# EAGLE design Brava Monio (EAGLE 8.0.0)
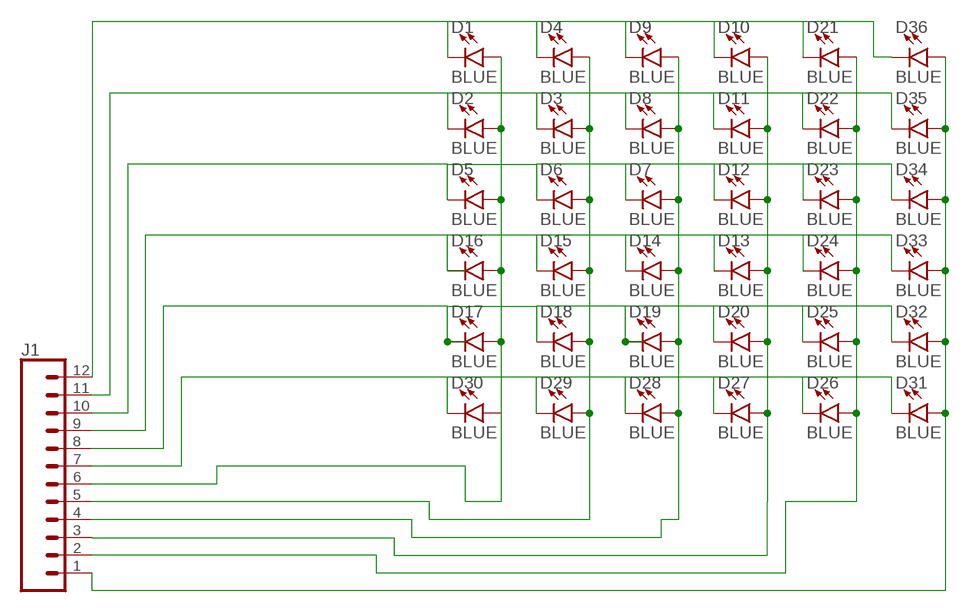
[diagram p0: schematic, sheet 1]

## Parts
D1  BLUE  LED-BLUE0603  [LED-0603]
D2  BLUE  LED-BLUE0603  [LED-0603]
D3  BLUE  LED-BLUE0603  [LED-0603]
D4  BLUE  LED-BLUE0603  [LED-0603]
D5  BLUE  LED-BLUE0603  [LED-0603]
D6  BLUE  LED-BLUE0603  [LED-0603]
D7  BLUE  LED-BLUE0603  [LED-0603]
D8  BLUE  LED-BLUE0603  [LED-0603]
D9  BLUE  LED-BLUE0603  [LED-0603]
D10  BLUE  LED-BLUE0603  [LED-0603]
D11  BLUE  LED-BLUE0603  [LED-0603]
D12  BLUE  LED-BLUE0603  [LED-0603]
D13  BLUE  LED-BLUE0603  [LED-0603]
D14  BLUE  LED-BLUE0603  [LED-0603]
D15  BLUE  LED-BLUE0603  [LED-0603]
D16  BLUE  LED-BLUE0603  [LED-0603]
D17  BLUE  LED-BLUE0603  [LED-0603]
D18  BLUE  LED-BLUE0603  [LED-0603]
D19  BLUE  LED-BLUE0603  [LED-0603]
D20  BLUE  LED-BLUE0603  [LED-0603]
D21  BLUE  LED-BLUE0603  [LED-0603]
D22  BLUE  LED-BLUE0603  [LED-0603]
D23  BLUE  LED-BLUE0603  [LED-0603]
D24  BLUE  LED-BLUE0603  [LED-0603]
D25  BLUE  LED-BLUE0603  [LED-0603]
D26  BLUE  LED-BLUE0603  [LED-0603]
D27  BLUE  LED-BLUE0603  [LED-0603]
D28  BLUE  LED-BLUE0603  [LED-0603]
D29  BLUE  LED-BLUE0603  [LED-0603]
D30  BLUE  LED-BLUE0603  [LED-0603]
D31  BLUE  LED-BLUE0603  [LED-0603]
D32  BLUE  LED-BLUE0603  [LED-0603]
D33  BLUE  LED-BLUE0603  [LED-0603]
D34  BLUE  LED-BLUE0603  [LED-0603]
D35  BLUE  LED-BLUE0603  [LED-0603]
D36  BLUE  LED-BLUE0603  [LED-0603]
J1  CONN_12LONGPADS  [1X12_LONGPADS]

## Nets
N$1: D1.A D2.A D5.A D16.A D17.A D30.A J1.6
N$2: D3.A D4.A D6.A D15.A D18.A D29.A J1.5
N$3: D7.A D8.A D9.A D14.A D19.A D28.A J1.4
N$4: D10.A D11.A D12.A D13.A D20.A D27.A J1.3
N$5: D21.A D22.A D23.A D24.A D25.A D26.A J1.2
N$6: D31.A D32.A D33.A D34.A D35.A D36.A J1.1
N$7: D1.C D4.C D9.C D10.C D21.C D36.C J1.12
N$8: D2.C D3.C D8.C D11.C D22.C D35.C J1.11
N$9: D5.C D6.C D7.C D12.C D23.C D34.C J1.10
N$10: D13.C D14.C D15.C D16.C D24.C D33.C J1.9
N$12: D17.C D18.C D19.C D20.C D25.C D32.C J1.8
N$13: D26.C D27.C D28.C D29.C D30.C D31.C J1.7

## Library data of the parts
D1-D36 = SparkFun-LED:LED-BLUE: Blue SMD LED Used in manufacturing of various products at SparkFun Packages: 0603 - SMD 0603 package [Product Link] <http://www.digikey.com/product-detail/en/SMLE12BC7TT86/511-1589-2-ND/1641808> 1206 - SMD1206 package [Product Link] <http://www.digikey.com/product-detail/en/lite-on-inc/LTST-C150TBKT/160-1643-1-ND/573584> SparkFun Products: ESP8266 Thing-Dev Board <https://www.sparkfun.com/products/13711> RedBoard <https://www.sparkfun.com/products/12757>; PROD_ID: DIO-08575
J1 = SparkFun-Connectors:CONN_12: Multi connection point. Often used as Generic Header-pin footprint for 0.1 inch spaced/style header connections On any of the 0.1 inch spaced packages, you can populate with these: Break Away Headers - Straight <https://www.sparkfun.com/products/116> (PRT-00116) Break Away Male Headers - Right Angle <https://www.sparkfun.com/products/553> (PRT-00553) Female Headers <https://www.sparkfun.com/products/115> (PRT-00115) Break Away Headers - Machine Pin <https://www.sparkfun.com/products/117> (PRT-00117) Break Away Female Headers - Swiss Machine Pin <https://www.sparkfun.com/products/743> (PRT-00743) For SCREWTERMINALS and SPRING TERMINALS visit here: Screw Terimnals on SparkFun.com <https://www.sparkfun.com/search/results?term=Screw+Terminals> (5mm/3.5mm/2.54mm spacing) This device is also useful as a general connection point to wire up your design to another part of your project. Our various solder wires solder well into these plated through hole pads. Hook-Up Wire - Assortment (Stranded, 22 AWG) <https://www.sparkfun.com/products/11375> (PRT-11375) Hook-Up Wire - Assortment (Solid Core, 22 AWG) <https://www.sparkfun.com/products/11367> (PRT-11367) View the entire wire category on our website here <https://www.sparkfun.com/categories/141> Special notes: Molex polarized connector foot print use with SKU : PRT-08231 with associated crimp pins and housings. 1MM SMD Version SKU: PRT-10208 NOTES ON THE VARIANTS LOCK and LOCK_LONGPADS... This footprint was designed to help hold the alignment of a through-hole component (i.e. 6-pin header) while soldering it into place. You may notice that each hole has been shifted either up or down by 0.005 of an inch from it's more standard position (which is a perfectly straight line). This slight alteration caused the pins (the squares in the middle) to touch the edges of the holes. Because they are alternating, it causes a "brace" to hold the component in place. 0.005 has proven to be the perfect amount of "off-center" position when using our standard breakaway headers. Although looks a little odd when you look at the bare footprint, once you have a header in there, the alteration is very hard to notice. Also,if you push a header all the way into place, it is covered up entirely on the bottom side.

## Board
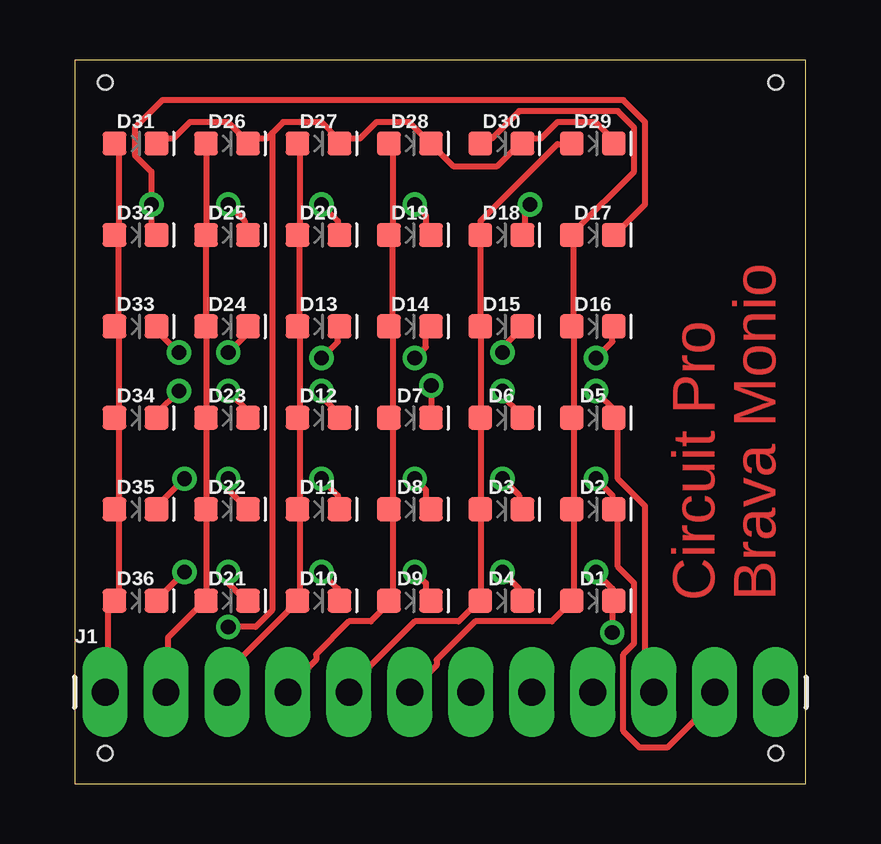
[diagram p1: board, top side]
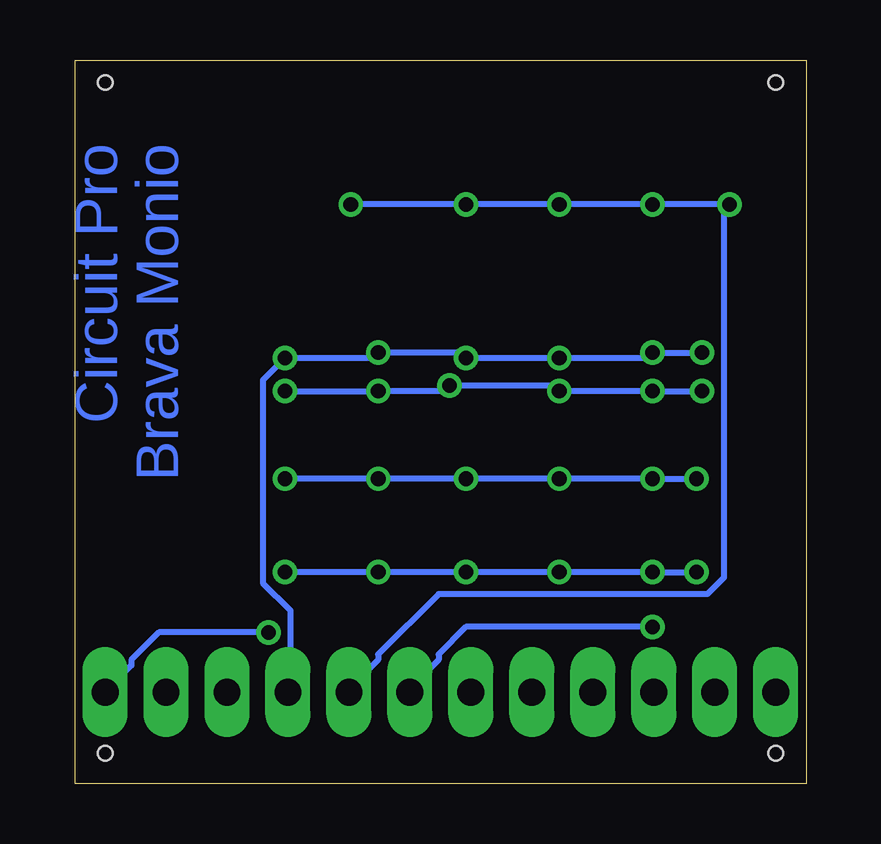
[diagram p2: board, bottom side, seen from below]

Size 30.46 x 30.15 mm. Coordinates in mm from the lower left corner, seen from the top.
Outline: 0,0 30.46,0 30.46,30.15 0,30.15 0,0
Copper layers (1*16): Top 0.035mm / dielectric 1.5mm / Bottom 0.035mm
Design rules "default": minimum track width 10mil, minimum drill 24mil, track to track 8mil, track to pad 8mil, pad to pad 8mil, via to via 8mil, smd to smd 8mil, copper to edge 40mil, drill to drill 8mil, minimum pad ring 10mil, minimum via ring 8mil, stop-mask expansion 4mil, vias tented up to drill 0mil, thermal gap 10mil
Holes 0.6 mm at 1.27,1.27 29.21,1.27 29.21,29.21 1.27,29.21

### Footprints (pad centres in the part's own frame; a part is rotated, then mirrored left to right if it is on the bottom)
LED-0603 = smd 1 x 1: A -0.877,0; C 0.877,0
1X12_LONGPADS = drill 1.118 pad 1.88 long: 1 0,0; 2 2.54,0; 3 5.08,0; 4 7.62,0; 5 10.16,0; 6 12.7,0; 7 15.24,0; 8 17.78,0; 9 20.32,0; 10 22.86,0; 11 25.4,0; 12 27.94,0

### Placement (x,y rotation side)
D1  21.59,7.62 0 top
D2  21.59,11.43 0 top
D3  17.78,11.43 0 top
D4  17.78,7.62 0 top
D5  21.59,15.24 0 top
D6  17.78,15.24 0 top
D7  13.97,15.24 0 top
D8  13.97,11.43 0 top
D9  13.97,7.62 0 top
D10  10.16,7.62 0 top
D11  10.16,11.43 0 top
D12  10.16,15.24 0 top
D13  10.16,19.05 0 top
D14  13.97,19.05 0 top
D15  17.78,19.05 0 top
D16  21.59,19.05 0 top
D17  21.59,22.86 0 top
D18  17.78,22.86 0 top
D19  13.97,22.86 0 top
D20  10.16,22.86 0 top
D21  6.35,7.62 0 top
D22  6.35,11.43 0 top
D23  6.35,15.24 0 top
D24  6.35,19.05 0 top
D25  6.35,22.86 0 top
D26  6.35,26.67 0 top
D27  10.16,26.67 0 top
D28  13.97,26.67 0 top
D29  21.59,26.67 0 top
D30  17.78,26.67 0 top
D31  2.54,26.67 0 top
D32  2.54,22.86 0 top
D33  2.54,19.05 0 top
D34  2.54,15.24 0 top
D35  2.54,11.43 0 top
D36  2.54,7.62 0 top
J1  1.27,3.81 0 top

### Tracks (layer width: path | path; a pad name or v marks a point on that pad's centre or on a via)
N$1
  Top 0.254: D30.A 16.92,26.87 17.37,26.87 18.52,28.02 22.63,28.02 23.32,27.33 23.32,25.5 20.8,22.99 D17.A 20.8,22.76 20.8,19.1 D16.A 20.8,18.87 20.8,15.44 D5.A 20.8,15.21 20.8,11.56 D2.A 20.8,11.33 20.8,7.67 D1.A 20.57,7.44 19.89,6.76 16.69,6.76 15.09,5.16 15.09,4.93 J1.6
N$2
  Top 0.254: D29.A 20.57,26.64 20.12,26.64 16.92,23.44 16.92,22.99 D18.A 16.92,22.76 16.92,19.1 D15.A 16.92,18.87 16.92,15.44 D6.A 16.92,15.21 16.92,11.56 D3.A 16.92,11.33 16.92,7.67 D4.A 16.69,7.44 16,6.76 14.17,6.76 11.43,4.01 J1.5
N$3
  Top 0.254: D28.A 13.26,26.64 13.26,22.99 D19.A 13.26,22.76 13.26,19.1 D14.A 13.26,18.87 13.26,15.44 D7.A 13.26,15.21 13.26,11.56 D8.A 13.26,11.33 13.26,7.67 D9.A 13.03,7.44 12.34,6.76 11.43,6.76 10.06,5.38 10.06,5.16 8.91,4.01 J1.4
N$4
  Top 0.254: D27.A 9.37,26.64 9.37,22.99 D20.A 9.37,22.76 9.37,19.1 D13.A 9.37,18.87 9.37,15.44 D12.A 9.37,15.21 9.37,11.56 D11.A 9.37,11.33 9.37,7.67 D10.A 9.14,7.44 6.4,4.7 6.4,4.01 J1.3
N$5
  Top 0.254: D26.A 5.49,26.64 5.49,22.99 D25.A 5.49,22.76 5.49,19.1 D24.A 5.49,18.87 5.49,15.44 D23.A 5.49,15.21 5.49,11.56 D22.A 5.49,11.33 5.49,7.67 D21.A 5.26,7.44 3.89,6.07 3.89,4.01 J1.2
N$6
  Top 0.254: D31.A 1.83,26.64 1.83,22.99 D32.A 1.83,22.76 1.83,19.1 D33.A 1.83,18.87 1.83,15.44 D34.A 1.83,15.21 1.83,11.56 D35.A 1.83,11.33 1.83,7.67 D36.A 1.6,7.44 1.37,7.21 1.37,4.01 J1.1
N$7  (via drill 0.61)
  Top 0.254: v4.57,8.81 3.43,7.67 D36.C | v6.4,8.81 6.4,8.36 7.09,7.67 D21.C | v10.29,8.81 10.97,8.13 10.97,7.67 D10.C | v14.17,8.81 14.63,8.36 14.63,7.67 D9.C | v17.83,8.81 18.52,8.13 18.52,7.67 D4.C | v21.72,8.81 22.4,8.13 22.4,7.67 D1.C 22.4,7.44 v22.4,6.3
  Bottom 0.254: v4.57,8.81 v6.4,8.81 v10.29,8.81 v14.17,8.81 v17.83,8.81 v21.72,8.81 | v22.4,6.3 26.98,6.3 28.12,5.16 28.12,4.93 29.03,4.01 J1.12
N$8  (via drill 0.61)
  Top 0.254: J1.11 26.52,3.79 26.52,3.33 24.69,1.5 23.55,1.5 22.86,2.18 22.86,5.38 23.32,5.84 23.32,8.36 22.63,9.04 22.63,11.33 D2.C 22.4,11.56 22.4,12.01 v21.72,12.7 | v4.57,12.7 3.43,11.56 D35.C | v6.4,12.7 6.4,12.24 7.09,11.56 D22.C | v10.29,12.7 10.97,12.01 10.97,11.56 D11.C | v14.17,12.7 14.63,12.24 14.63,11.56 D8.C | v17.83,12.7 18.52,12.01 18.52,11.56 D3.C
  Bottom 0.254: v4.57,12.7 v6.4,12.7 v10.29,12.7 v14.17,12.7 v17.83,12.7 v21.72,12.7
N$9  (via drill 0.61)
  Top 0.254: v4.34,16.36 3.43,15.44 D34.C | v6.4,16.36 7.32,15.44 D23.C | v10.29,16.36 10.29,16.13 10.97,15.44 D12.C | v14.86,16.59 14.86,15.44 D7.C | v17.83,16.36 17.83,16.13 18.52,15.44 D6.C | J1.10 24,4.01 23.77,4.24 23.77,11.56 22.63,12.7 22.63,15.21 D5.C 22.63,15.44 v21.72,16.36
  Bottom 0.254: v4.34,16.36 v6.4,16.36 v10.29,16.36 10.52,16.59 v14.86,16.59 15.09,16.36 v17.83,16.36 v21.72,16.36
N$10  (via drill 0.61)
  Top 0.254: v4.34,17.96 3.43,18.87 D33.C | v6.4,17.96 7.32,18.87 D24.C | v10.29,17.73 10.97,18.41 10.97,18.87 D13.C | v14.17,17.73 14.63,18.19 14.63,18.87 D14.C | v17.83,17.96 17.83,18.19 18.52,18.87 D15.C | v21.72,17.73 22.4,18.41 22.4,18.87 D16.C
  Bottom 0.254: v4.34,17.96 v6.4,17.96 6.63,17.73 v10.29,17.73 v14.17,17.73 14.4,17.96 v17.83,17.96 18.06,17.73 v21.72,17.73 22.63,16.82 22.63,8.36 21.49,7.21 21.49,4.01 J1.9
N$12  (via drill 0.61)
  Top 0.254: D32.C 3.2,22.99 v3.2,24.13 3.2,25.5 2.52,26.19 2.52,27.33 3.66,28.47 22.86,28.47 23.77,27.56 23.77,24.13 22.63,22.99 D17.C | v6.4,24.13 7.09,23.44 7.09,22.99 D25.C | v10.29,24.13 10.97,23.44 10.97,22.99 D20.C | v14.17,24.13 14.63,23.67 14.63,22.99 D19.C | v18.97,24.13 18.75,23.9 18.75,22.99 D18.C
  Bottom 0.254: 3.43,24.13 v6.4,24.13 v10.29,24.13 v14.17,24.13 v18.97,24.13 | 3.43,24.13 3.43,8.59 4.12,7.9 15.32,7.9 17.83,5.38 17.83,5.16 18.97,4.01 J1.8 | 3.43,24.13 v3.2,24.13
N$13  (via drill 0.61)
  Top 0.254: D29.C 22.4,26.87 21.72,27.56 20.12,27.56 19.43,26.87 18.75,26.87 D30.C 18.52,26.64 17.6,25.73 15.77,25.73 14.86,26.64 D28.C 14.63,26.87 13.95,27.56 12.57,27.56 11.89,26.87 11.2,26.87 D27.C 10.97,26.87 10.29,27.56 8.69,27.56 8.23,27.1 | D31.C 3.43,26.87 4.12,26.87 4.8,27.56 6.4,27.56 7.09,26.87 D26.C 7.32,26.87 8,26.87 8.23,27.1 | v6.4,6.53 7.54,6.53 8.23,7.21 8.23,27.1
  Bottom 0.254: v6.4,6.53 14.17,6.53 15.32,5.38 15.32,5.16 16.46,4.01 J1.7

### Text on the board
Top: Circuit Pro | Brava Monio
Bottom: Brava Monio | Circuit Pro